# EAGLE design e407-roll-control (EAGLE 6.4)
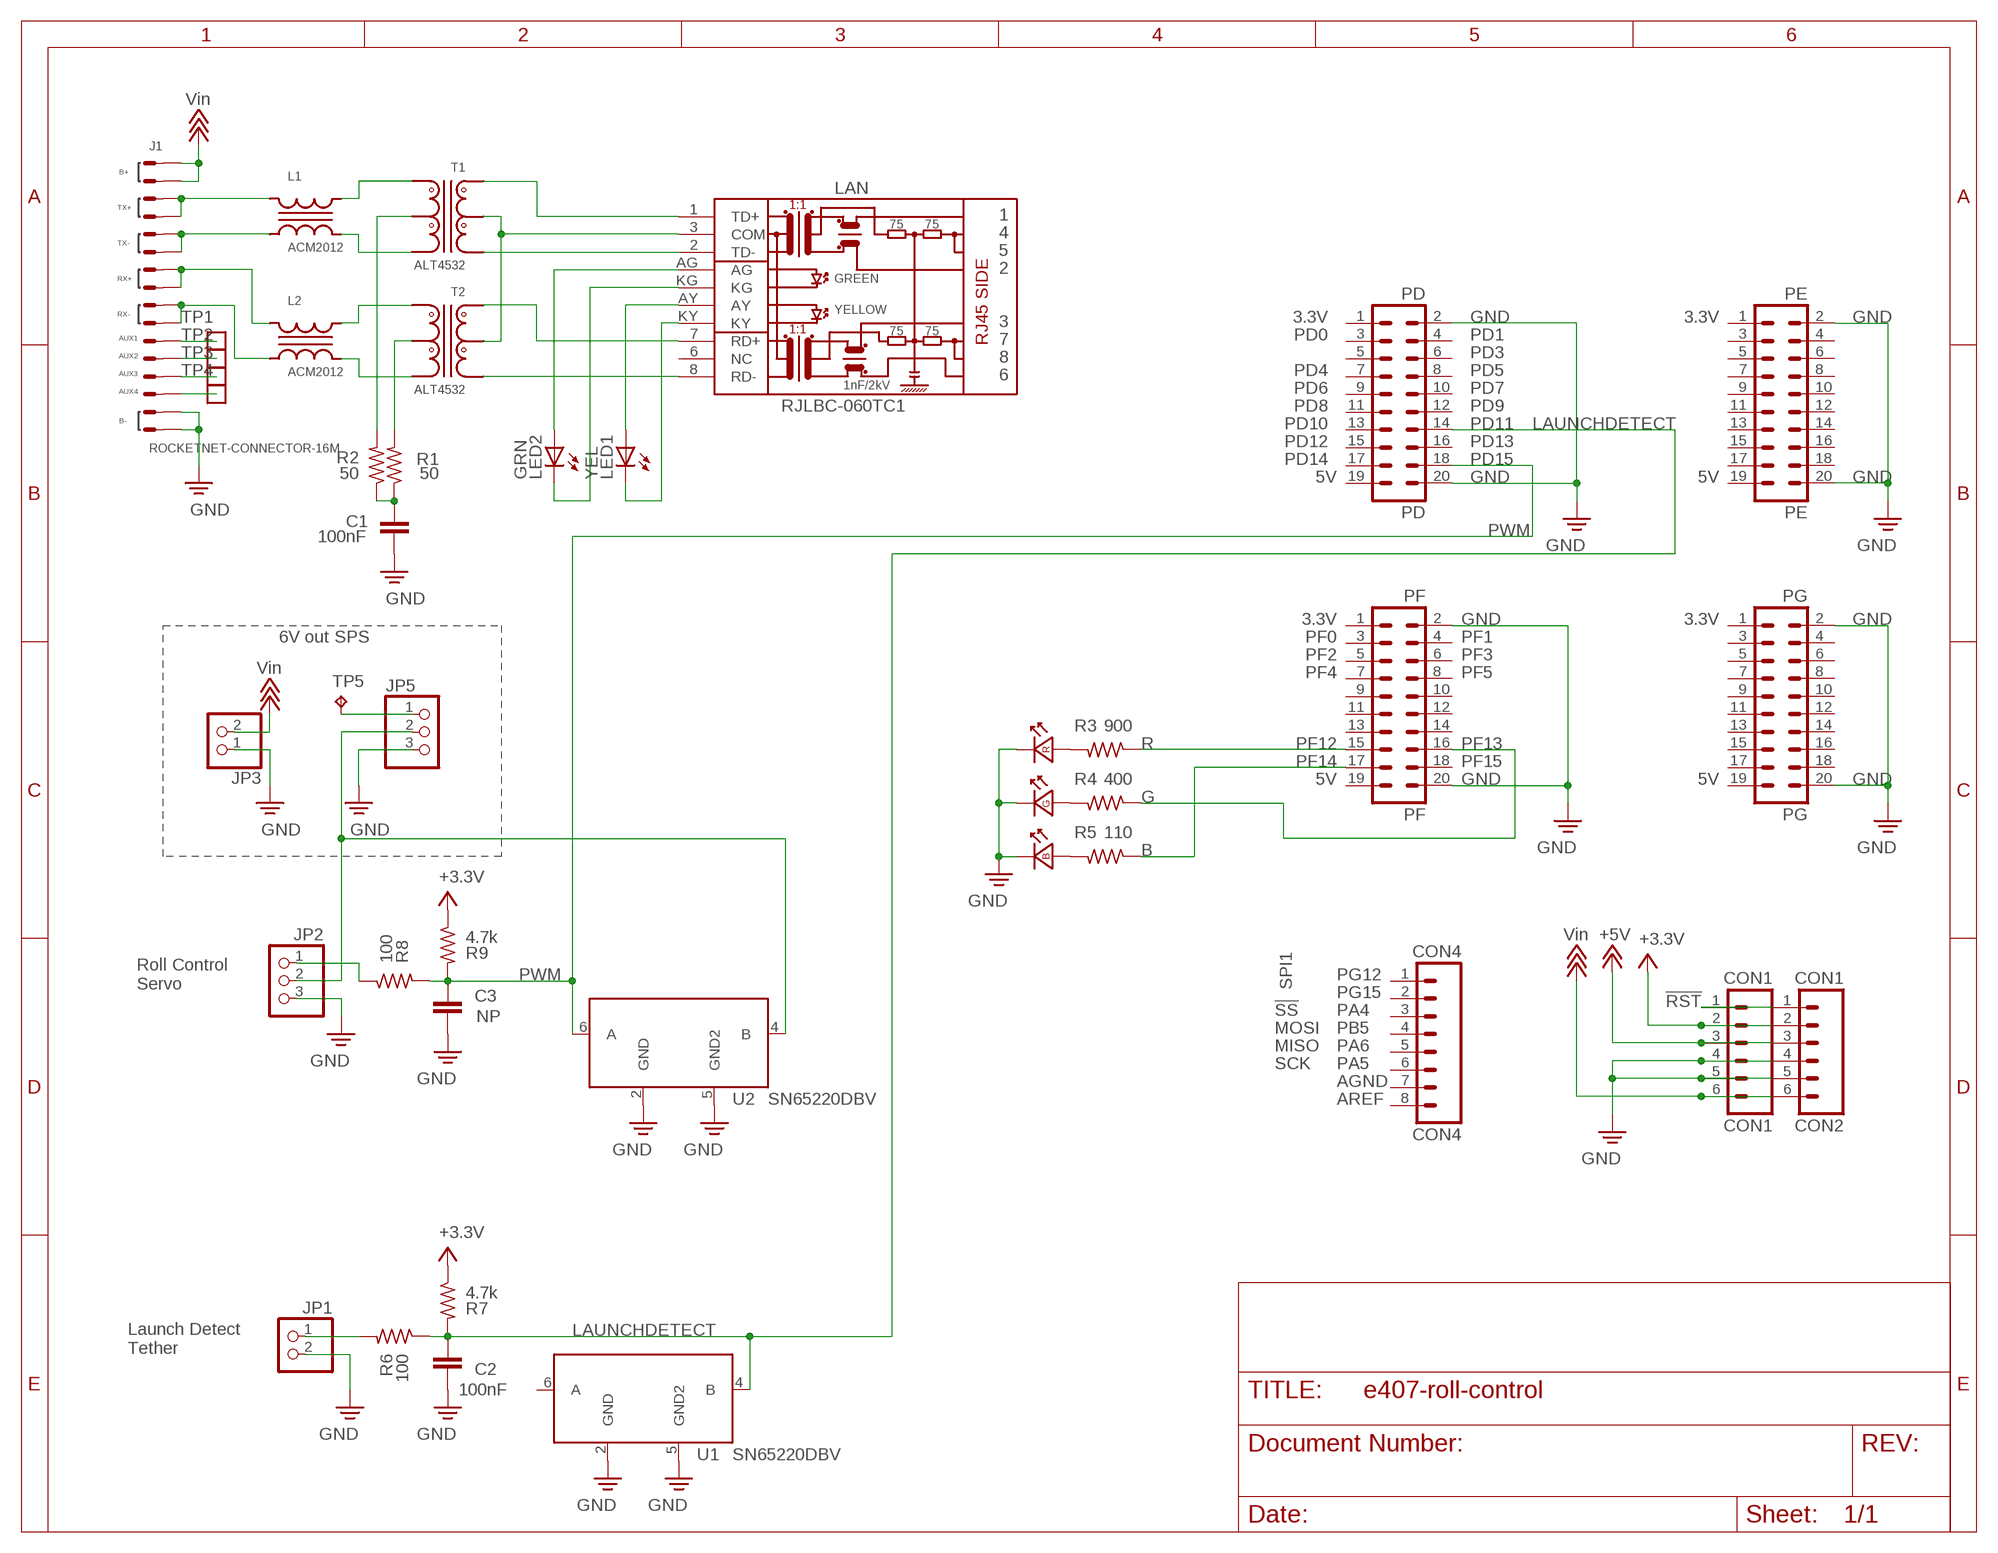
[diagram p0: schematic, sheet 1]

## Parts
C1  100nF  C-EU0603-B-NOSILK  [0603-B-NOSILK]
C2  100nF  C-EU0603-B-NOSILK  [0603-B-NOSILK]
C3  NP  C-EU0603-B-NOSILK  [0603-B-NOSILK]
CON1  CON1  M06SIP  [1X06]
CON2  CON1  M06SIP  [1X06]
CON4  CON4  M081X08  [1X08]
J1  ROCKETNET-CONNECTOR-16M  [ROCKETNET-M-16]
JP1  PINHD-1X2  [1X02]
JP2  PINHD-1X3  [1X03]
JP3  PINHD-1X2  [1X02]
JP5  PINHD-1X3  [1X03]
L1  ACM2012  [TDK-ACM2012]
L2  ACM2012  [TDK-ACM2012]
LAN  RJLBC-060TC1  [RJLBC-060TC1]
LED1  YEL  LEDCHIPLED_0603  [CHIPLED_0603]
LED2  GRN  LEDCHIPLED_0603  [CHIPLED_0603]
LED3  LED_RGB_PLCC-6  [PLCC-6]
PD  PD  ML20  [ML20]
PE  PE  ML20  [ML20]
PF  PF  ML20  [ML20]
PG  PG  ML20  [ML20]
R1  50  R-US_0603-B-NOSILK  [0603-B-NOSILK]
R2  50  R-US_0603-B-NOSILK  [0603-B-NOSILK]
R3  900  R-US_0603-B-NOSILK  [0603-B-NOSILK]
R4  400  R-US_0603-B-NOSILK  [0603-B-NOSILK]
R5  110  R-US_0603-B-NOSILK  [0603-B-NOSILK]
R6  100  R-US_0603-B-NOSILK  [0603-B-NOSILK]
R7  4.7k  R-US_0603-B-NOSILK  [0603-B-NOSILK]
R8  100  R-US_0603-B-NOSILK  [0603-B-NOSILK]
R9  4.7k  R-US_0603-B-NOSILK  [0603-B-NOSILK]
T1  ALT4532  [TDK-ALT4532]
T2  ALT4532  [TDK-ALT4532]
TP1  TEST-POINT  [2MM-TEST-POINT]
TP2  TEST-POINT  [2MM-TEST-POINT]
TP3  TEST-POINT  [2MM-TEST-POINT]
TP4  TEST-POINT  [2MM-TEST-POINT]
TP5  TPPAD1-13  [P1-13]
U1  SN65220DBV  [SOT23-6L]
U2  SN65220DBV  [SOT23-6L]

## Nets
B: PF.17 R5.1
DOUBLE_UP_ARROW: CON1.3 CON2.3 ; supply symbol labelled +5V
G: PF.16 R4.1
LAUNCHDETECT: C2.2 PD.14 R6.1 R7.2 U1.4(B)
N$3: L1.4 T1.5
N$4: CON1.1 CON2.1
N$5: L1.3 T1.4
N$6: L2.4 T2.5
N$7: L2.3 T2.4
N$8: J1.T+@13(TX+) J1.T+@14(TX+) L1.1
N$9: J1.T-@9(TX-) J1.T-@11(TX-) L1.2
N$10: J1.R+@5(RX+) J1.R+@7(RX+) L2.1
N$11: LAN.1(TD+) T1.1
N$12: LAN.2(TD-) T1.2
N$13: LAN.7(RD+) T2.1
N$14: LAN.8(RD-) T2.2
N$15: LAN.KY LED1.C
N$16: LAN.AY LED1.A
N$17: LAN.KG LED2.C
N$18: LAN.AG LED2.A
N$19: J1.R-@3(RX-) J1.R-@4(RX-) L2.2
N$20: J1.A4(AUX4) TP4.1
N$21: J1.A3(AUX3) TP3.1
N$22: J1.A2(AUX2) TP2.1
N$23: J1.A1(AUX1) TP1.1
N$24: LAN.3(COM) T1.6 T2.6
N$25: C1.1 R1.1 R2.1
N$26: R1.2 T2.3
N$27: R2.2 T1.3
N$28: LED3.1(R:A) R3.2
N$29: LED3.3(G:A) R4.2
N$30: LED3.4(B:A) R5.2
N$31: JP1.1 R6.2
N$32: JP5.1 TP5.TP
N$33: JP2.1 R8.1
N$34: JP2.2 JP5.2 U2.4(B)
PWM: C3.2 PD.18 R8.2 R9.2 U2.6(A)
R: PF.15 R3.1
TRIPLE_BAR_GND: C1.2 C2.1 C3.1 CON1.4 CON1.5 CON2.4 CON2.5 J1.B-@1(B-) J1.B-@2(B-) JP1.2 JP2.3 JP3.1 JP5.3 LED3.2(G:K) LED3.5(B:K) LED3.6(R:K) PD.2 PD.20 PE.2 PE.20 PF.2 PF.20 PG.2 PG.20 U1.2(GND) U1.5(GND2) U2.2(GND) U2.5(GND2) ; supply symbol labelled GND
TRIPLE_UP_ARROW: CON1.6 CON2.6 J1.B+@15(B+) J1.B+@16(B+) JP3.2 ; supply symbol labelled Vin
UP_ARROW: CON1.2 CON2.2 R7.1 R9.1 ; supply symbol labelled +3.3V
Unconnected: CON4.1 CON4.2 CON4.3 CON4.4 CON4.5 CON4.6 CON4.7 CON4.8 LAN.6(NC) PD.1 PD.3 PD.4 PD.5 PD.6 PD.7 PD.8 PD.9 PD.10 PD.11 PD.12 PD.13 PD.15 PD.16 PD.17 PD.19 PE.1 PE.3 PE.4 PE.5 PE.6 PE.7 PE.8 PE.9 PE.10 PE.11 PE.12 PE.13 PE.14 PE.15 PE.16 PE.17 PE.18 PE.19 PF.1 PF.3 PF.4 PF.5 PF.6 PF.7 PF.8 PF.9 PF.10 PF.11 PF.12 PF.13 PF.14 PF.18 PF.19 PG.1 PG.3 PG.4 PG.5 PG.6 PG.7 PG.8 PG.9 PG.10 PG.11 PG.12 PG.13 PG.14 PG.15 PG.16 PG.17 PG.18 PG.19 U1.6(A)

## Notes on the sheet
- 3.3V | GND | 3.3V | GND
- PD0 | PD1
- PD3
- PD4 | PD5
- PD6 | PD7
- PD8 | PD9
- PD10 | PD11
- PD12 | PD13
- PD14 | PD15
- 5V | GND | 5V | GND
- 3.3V | GND | 3.3V | GND
- 6V out SPS | PF0 | PF1
- PF2 | PF3
- PF4 | PF5
- PF12 | PF13
- PF14 | PF15
- 5V | GND | 5V | GND
- PG12
- Roll Control
  Servo
- SPI1
- PG15
- !RST
- !SS | PA4
- MOSI | PB5
- MISO | PA6
- SCK | PA5
- AGND
- AREF
- Launch Detect
  Tether

## Library data of the parts
C1-C3 = rcl_custom:C-EU: CAPACITOR, European symbol
CON1 CON2 = SparkFun-Connectors:M06: Header 6 Standard 6-pin 0.1" header. Use with straight break away headers (SKU : PRT-00116), right angle break away headers (PRT-00553), swiss pins (PRT-00743), machine pins (PRT-00117), and female headers (PRT-00115). Molex polarized connector foot print use with SKU : PRT-08094 with associated crimp pins and housings. NOTES ON THE VARIANTS LOCK and LOCK_LONGPADS... This footprint was designed to help hold the alignment of a through-hole component (i.e. 6-pin header) while soldering it into place. You may notice that each hole has been shifted either up or down by 0.005 of an inch from it's more standard position (which is a perfectly straight line). This slight alteration caused the pins (the squares in the middle) to touch the edges of the holes. Because they are alternating, it causes a "brace" to hold the component in place. 0.005 has proven to be the perfect amount of "off-center" position when using our standard breakaway headers. Although looks a little odd when you look at the bare footprint, once you have a header in there, the alteration is very hard to notice. Also, if you push a header all the way into place, it is covered up entirely on the bottom side. This idea of altering the position of holes to aid alignment will be further integrated into the Sparkfun Library for other footprints. It can help hold any component with 3 or more connection pins.
CON4 = SparkFun-Connectors:M08: Header 8 Standard 8-pin 0.1" header. Use with straight break away headers (SKU : PRT-00116), right angle break away headers (PRT-00553), swiss pins (PRT-00743), machine pins (PRT-00117), and female headers (PRT-00115).
J1 = rocketnet-connector:ROCKETNET-CONNECTOR-16
JP1 JP3 = pinhead:PINHD-1X2: PIN HEADER
JP2 JP5 = pinhead:PINHD-1X3: PIN HEADER
L1 L2 = magnetics:ACM2012
LAN = OLIMEX_CONNECTORS:RJLBC-060TC1
LED1 LED2 = led:LED: LED OSRAM: - CHIPLED LG R971, LG N971, LY N971, LG Q971, LY Q971, LO R971, LY R971 LH N974, LH R974 LS Q976, LO Q976, LY Q976 LO Q996 - Hyper CHIPLED LW Q18S LB Q993, LB Q99A, LB R99A - SideLED LS A670, LO A670, LY A670, LG A670, LP A670 LB A673, LV A673, LT A673, LW A673 LH A674 LY A675 LS A676, LA A676, LO A676, LY A676, LW A676 LS A679, LY A679, LG A679 - Hyper Micro SIDELED® LS Y876, LA Y876, LO Y876, LY Y876 LT Y87S - SmartLED LW L88C, LW L88S LB L89C, LB L89S, LG L890 LS L89K, LO L89K, LY L89K LS L896, LA L896, LO L896, LY L896 - TOPLED LS T670, LO T670, LY T670, LG T670, LP T670 LSG T670, LSP T670, LSY T670, LOP T670, LYG T670 LG T671, LOG T671, LSG T671 LB T673, LV T673, LT T673, LW T673 LH T674 LS T676, LA T676, LO T676, LY T676, LB T676, LH T676, LSB T676, LW T676 LB T67C, LV T67C, LT T67C, LS T67K, LO T67K, LY T67K, LW E67C LS E67B, LA E67B, LO E67B, LY E67B, LB E67C, LV E67C, LT E67C LW T67C LS T679, LY T679, LG T679 LS T770, LO T770, LY T770, LG T770, LP T770 LB T773, LV T773, LT T773, LW T773 LH T774 LS E675, LA E675, LY E675, LS T675 LS T776, LA T776, LO T776, LY T776, LB T776 LHGB T686 LT T68C, LB T68C - Hyper Mini TOPLED® LB M676 - Mini TOPLED Santana® LG M470 LS M47K, LO M47K, LY M47K Source: http://www.osram.convergy.de LUXEON: - LUMILED® LXK2-PW12-R00, LXK2-PW12-S00, LXK2-PW14-U00, LXK2-PW14-V00 LXK2-PM12-R00, LXK2-PM12-S00, LXK2-PM14-U00 LXK2-PE12-Q00, LXK2-PE12-R00, LXK2-PE12-S00, LXK2-PE14-T00, LXK2-PE14-U00 LXK2-PB12-K00, LXK2-PB12-L00, LXK2-PB12-M00, LXK2-PB14-N00, LXK2-PB14-P00, LXK2-PB14-Q00 LXK2-PR12-L00, LXK2-PR12-M00, LXK2-PR14-Q00, LXK2-PR14-R00 LXK2-PD12-Q00, LXK2-PD12-R00, LXK2-PD12-S00 LXK2-PH12-R00, LXK2-PH12-S00 LXK2-PL12-P00, LXK2-PL12-Q00, LXK2-PL12-R00 Source: www.luxeon.com KINGBRIGHT: KA-3528ASYC Source: www.kingbright.com
LED3 = Tova:LED_RGB_*: RGB LED with separate contacts for all 3 chips
PD PE PF PG = con-harting-ml:ML20: HARTING; OC_FARNELL: unknown; OC_NEWARK: unknown
R1-R9 = rcl_custom:R-US_: RESISTOR, American symbol
T1 T2 = magnetics:ALT4532
TP1-TP4 = apdm:TEST-POINT
TP5 = testpad:TP: Test pad
U1 U2 = sn65220:SN65220

## Net classes
1 PWR: width 0.203 mm, drill 0.4 mm, clearance 0.076 mm

## Board
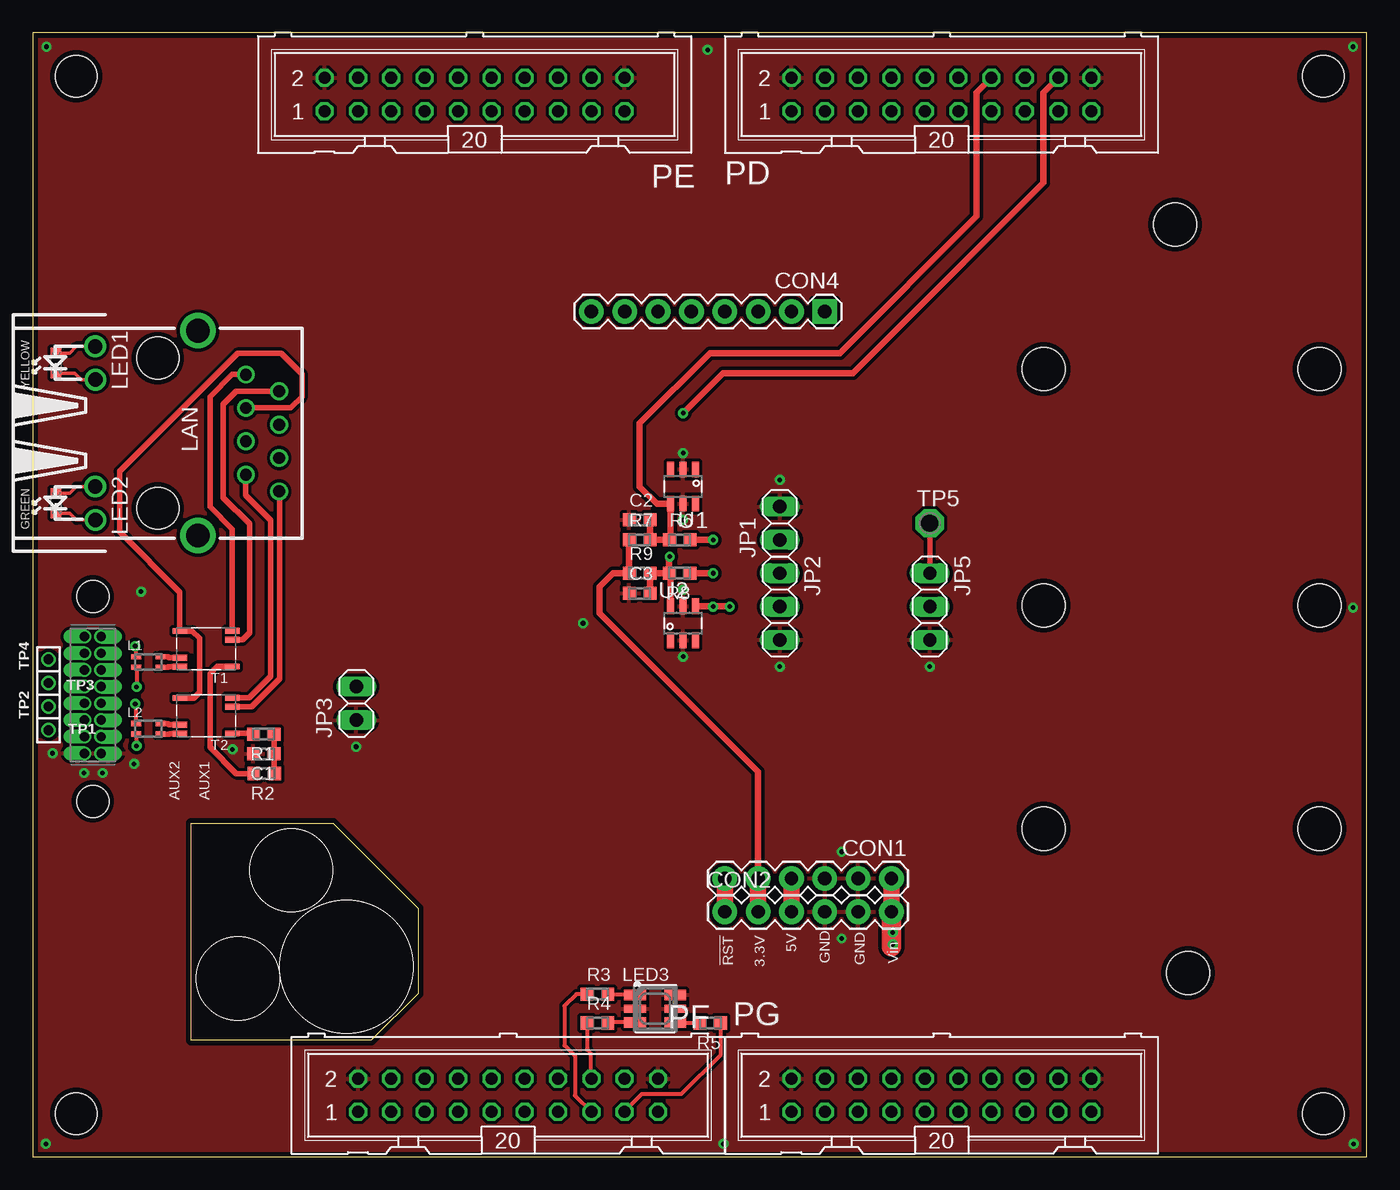
[diagram p1: board, top side]
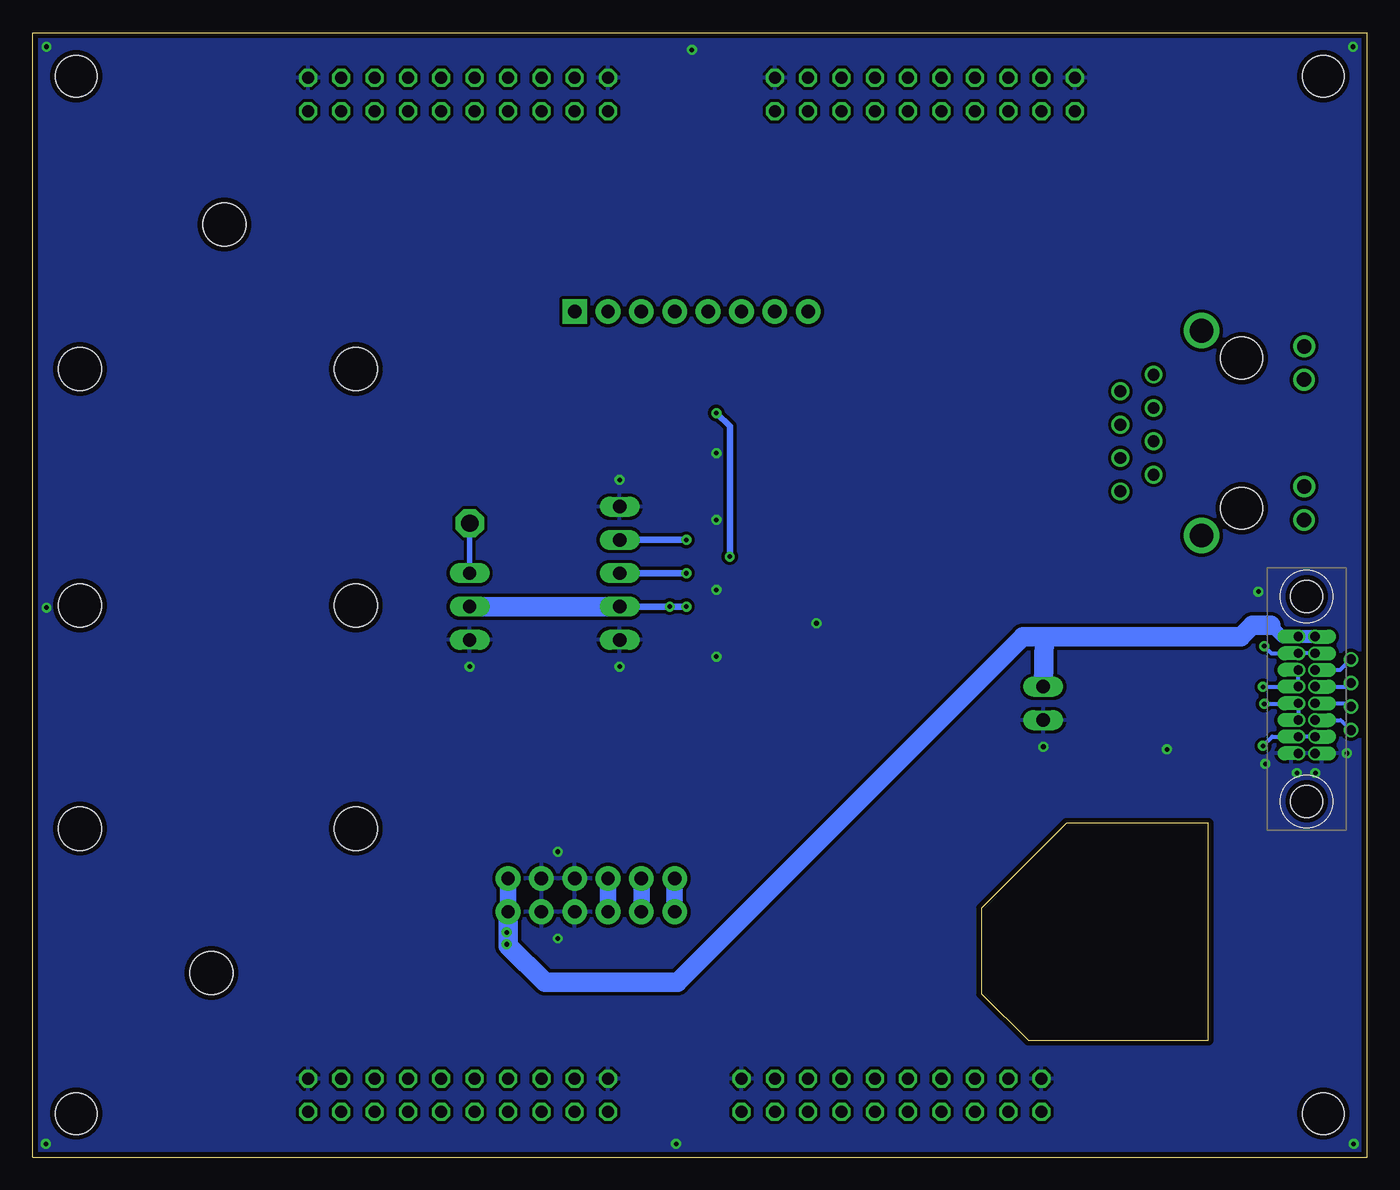
[diagram p2: board, bottom side, seen from below]

Size 101.6 x 85.6 mm. Coordinates in mm from the lower left corner, seen from the top.
Outline: 101.6,0 0,0 0,85.6 101.6,85.6 101.6,0
Outline: 25.78,8.89 12.06,8.89 12.06,25.4 22.86,25.4 29.34,18.92 29.34,12.45 25.78,8.89
Copper layers (1*16): Top 0.0178mm / dielectric 59mil / Bottom 0.0178mm
Design rules "epl-lpkf *": minimum track width 8mil, minimum drill 0.35mm, track to track 8mil, track to pad 8mil, pad to pad 8mil, via to via 8mil, smd to smd 8mil, copper to edge 15mil, drill to drill 15mil, minimum pad ring 0mil, minimum via ring 8mil, stop-mask expansion 1mil, vias tented up to drill 0mil, thermal gap 10mil
Holes 3.17 mm at 98.3,3.3 98.3,82.3 3.3,82.3 3.3,3.3
Holes 3.3 mm at 98,60 77,60 77,25 98,25 98,42 77,42 88,14 87,71

### Footprints (pad centres in the part's own frame; a part is rotated, then mirrored left to right if it is on the bottom)
0603-B-NOSILK = smd 0.95 x 1: 1 -0.8,0; 2 0.8,0
1X06 = drill 1.016 pad 1.88: 1 0,0; 2 2.54,0; 3 5.08,0; 4 7.62,0; 5 10.16,0; 6 12.7,0
1X08 = drill 1.016 pad 1.88 square: 1 0,0 | drill 1.016 pad 1.88: 2 2.54,0; 3 5.08,0; 4 7.62,0; 5 10.16,0; 6 12.7,0; 7 15.24,0; 8 17.78,0
ROCKETNET-M-16 = drill 0.71 pad 0.95 offset: A1 -1.905,0.635; A2 -0.635,0.635; A3 0.635,0.635; A4 1.905,0.635; B+@15 4.445,-0.635; B+@16 4.445,0.635; B-@1 -4.445,-0.635; B-@2 -4.445,0.635; R+@5 -1.905,-0.635; R+@7 -0.635,-0.635; R-@3 -3.175,-0.635; R-@4 -3.175,0.635; T+@13 3.175,-0.635; T+@14 3.175,0.635; T-@9 0.635,-0.635; T-@11 1.905,-0.635 | hole 2.438: 7.5,0; -8.1,0
1X02 = drill 1.016 long: 1 -1.27,0; 2 1.27,0
1X03 = drill 1.016 long: 1 -2.54,0; 2 0,0; 3 2.54,0
TDK-ACM2012 = smd 0.75 x 0.4: 1 -0.925,0.4; 2 -0.925,-0.4; 3 0.925,-0.4; 4 0.925,0.4
RJLBC-060TC1 = drill 0.9: 1 -4.455,6.7; 2 -3.185,9.24; 3 -1.915,6.7; 4 -0.645,9.24; 5 0.625,6.7; 6 1.895,9.24; 7 3.165,6.7; 8 4.435,9.24 | drill 1.1: AG 4.07,-4.773; AY -6.61,-4.773; KG 6.61,-4.748; KY -4.07,-4.748 | drill 1.8: GND1 -7.8,3.05; GND2 7.8,3.05 | hole 3.2: -5.715,0; 5.715,0
CHIPLED_0603 = smd 0.8 x 0.8: A 0,-0.75; C 0,0.75
PLCC-6 = smd 1.65 x 0.8: 1 -1.525,1.05; 3 -1.525,-1.05; 4 1.525,-1.05; 6 1.525,1.05 | smd 1.65 x 0.6: 2 -1.525,0; 5 1.525,0
ML20 = drill 0.914 octagon: 1 -11.43,-1.27; 2 -11.43,1.27; 3 -8.89,-1.27; 4 -8.89,1.27; 5 -6.35,-1.27; 6 -6.35,1.27; 7 -3.81,-1.27; 8 -3.81,1.27; 9 -1.27,-1.27; 10 -1.27,1.27; 11 1.27,-1.27; 12 1.27,1.27; 13 3.81,-1.27; 14 3.81,1.27; 15 6.35,-1.27; 16 6.35,1.27; 17 8.89,-1.27; 18 8.89,1.27; 19 11.43,-1.27; 20 11.43,1.27
TDK-ALT4532 = smd 1.1 x 0.45: 1 -2,-1.375; 2 -2,-0.675; 3 -2,1.35; 4 2,1.375; 5 2,0.675; 6 2,-1.35
2MM-TEST-POINT = drill 0.737: 1 0,0
P1-13 = drill 1.321 pad 2.159 octagon: TP 0,0
SOT23-6L = smd 0.55 x 1.2: 1 -0.95,-1.3; 2 0,-1.3; 3 0.95,-1.3; 4 0.95,1.3; 5 0,1.3; 6 -0.95,1.3

### Placement (x,y rotation side)
C1  17.6,30.7 180 top
C2  46.23,48.51 0 top
C3  46.23,42.93 0 top
CON1  52.7,21.21 0 top
CON2  52.7,18.67 0 top
CON4  60.33,64.39 180 top
J1  4.57,35.18 90 top
JP1  56.9,48.26 90 top
JP2  56.9,41.91 270 top
JP3  24.64,34.54 90 top
JP5  68.33,41.91 270 top
L1  8.8,37.7 0 top
L2  8.8,32.6 0 top
LAN  9.53,55.12 270 top
LED1  1.78,60.45 180 top
LED2  1.78,49.78 180 top
LED3  47.4,11.3 0 top
PD  69.22,80.9 0 top
PE  33.66,80.9 0 top
PF  36.2,4.7 0 top
PG  69.22,4.7 0 top
R1  17.6,32.2 180 top
R2  17.63,29.2 180 top
R3  43,12.4 0 top
R4  43,10.2 0 top
R5  51.6,10.2 180 top
R6  49.28,46.99 0 top
R7  46.23,46.99 0 top
R8  49.28,44.45 180 top
R9  46.23,44.45 0 top
T1  13.2,38.7 180 top
T2  13.2,33.6 180 top
TP1  1.2,32.5 0 top
TP2  1.2,34.3 0 top
TP3  1.2,36.1 0 top
TP4  1.2,37.9 0 top
TP5  68.33,48.26 0 top
U1  49.53,51.05 180 top
U2  49.53,40.64 0 top

### Tracks (layer width: path | path; a pad name or v marks a point on that pad's centre or on a via)
B
  Top 0.3: PF.17 45.09,3.48 46.4,4.8 49.4,4.8 52.4,7.8 R5.1
DOUBLE_UP_ARROW
  Top 1.27: CON1.3 CON2.3
  Bottom 1.27: CON1.3 CON2.3
G
  Top 0.3: R4.1 42.2,8.2 42.5,7.9 42.5,6.01 PF.16
LAUNCHDETECT
  Top 0.508: C2.2 R7.2 R6.1 48.58,47.09 U1.4 47.53,49.75 46.23,51.05 46.23,55.88 51.56,61.21 61.47,61.21 71.88,71.63 71.88,81.03 PD.14
N$3
  Top 0.406: T1.5 10.38,38.02 10.3,38.1 L1.4
N$4
  Top 1.27: CON1.1 CON2.1
  Bottom 1.27: CON1.1 CON2.1
N$5
  Top 0.406: T1.4 10.32,37.33 10.3,37.3 L1.3
N$6
  Top 0.406: T2.5 10.38,32.92 10.3,33 L2.4
N$7
  Top 0.406: T2.4 10.43,32.23 10.4,32.2 L2.3
N$8  (via drill 0.35)
  Top 0.3: L1.1 7.88,38.9 v7.8,38.9
  Bottom 0.3: J1.T+@14 J1.T+@13 7.25,38.35 v7.8,38.9
N$9  (via drill 0.35)
  Top 0.3: L1.2 7.9,37.27 v7.9,35.8
  Bottom 0.3: J1.T-@11 J1.T-@9 7.89,35.81 v7.9,35.8
N$10  (via drill 0.35)
  Top 0.3: L2.1 7.88,34.42 v7.8,34.5
  Bottom 0.3: J1.R+@5 J1.R+@7 5.25,34.5 v7.8,34.5
N$11
  Top 0.406: T1.1 15.2,47.8 13.5,49.5 13.5,57.9 15.2,59.6 16.2,59.6 LAN.1
N$12
  Top 0.406: T1.2 15.97,39.38 16.5,39.9 16.5,48.2 14.5,50.2 14.5,57.3 15.5,58.3 LAN.2
N$13
  Top 0.406: T2.1 16.48,34.98 18.1,36.6 18.1,48.5 16.2,50.4 16.2,51.93 LAN.7
N$14
  Top 0.406: T2.2 16.68,34.27 18.8,36.4 18.8,50.65 LAN.8
N$15
  Top 0.254: LAN.KY 3.68,59.19 3.17,59.69 LED1.C
N$16
  Top 0.254: LAN.AY 3.31,61.73 2.79,61.21 1.79,61.21 LED1.A
N$17
  Top 0.254: LAN.KG 3.31,48.51 2.79,49.02 LED2.C
N$18
  Top 0.254: LAN.AG 3.3,51.05 2.79,50.55 1.79,50.55 LED2.A
N$19  (via drill 0.35)
  Top 0.3: L2.2 7.88,31.32 v7.9,31.3
  Bottom 0.3: J1.R-@4 J1.R-@3 7.2,32 v7.9,31.3
N$20
  Bottom 0.3: J1.A4 2.02,37.08 TP4.1
N$21
  Bottom 0.3: J1.A3 1.49,35.81 TP3.1
N$22
  Bottom 0.3: J1.A2 1.44,34.54 TP2.1
N$23
  Bottom 0.3: J1.A1 1.97,33.27 TP1.1
N$24
  Top 0.406: T2.6 12.25,34.95 12.7,35.4 12.7,39.5 12.15,40.05 T1.6 11.2,43 6.6,47.6 6.6,52.2 15.6,61.2 18.9,61.2 20.5,59.6 20.5,57.9 19.63,57.03 LAN.3
N$25
  Top 0.406: R1.1 C1.1 18.4,29.23 R2.1
N$26
  Top 0.406: T2.3 16.78,32.25 R1.2
N$27
  Top 0.406: T1.3 14.05,37.35 13.5,36.8 13.5,31.2 15.5,29.2 R2.2
N$28
  Top 0.3: LED3.1 43.85,12.35 R3.2
N$29
  Top 0.3: LED3.3 43.85,10.25 R4.2
N$30
  Top 0.3: R5.2 48.98,10.2 LED3.4
N$31  (via drill 0.35)
  Top 0.508: v51.82,46.99 R6.2
  Bottom 0.508: JP1.1 v51.82,46.99
N$32
  Top 0.4: JP5.1 TP5.TP 68.37,48.3
  Bottom 0.4: TP5.TP JP5.1
N$33  (via drill 0.35)
  Top 0.508: v51.82,44.45 R8.1
  Bottom 0.508: JP2.1 v51.82,44.45
N$34  (via drill 0.35)
  Top 0.508: 56.87,41.94 JP2.2 | U2.4 51.79,41.94 | 51.79,41.94 v51.82,41.91 | 51.79,41.94 53.06,41.94 v53.09,41.91
  Bottom 0.508: v51.82,41.91 57.4,41.91
  Bottom 1.5: JP5.2 57.4,41.91 JP2.2
PWM  (via drill 0.35)
  Top 0.508: U2.6 48.58,44.3 R8.2 | C3.2 R9.2 R8.2 | R8.2 48.48,45.68 v48.51,45.72 | v49.53,56.64 52.58,59.69 62.48,59.69 76.96,74.17 76.96,81.03 PD.18
  Bottom 0.508: v48.51,45.72 48.51,55.63 v49.53,56.64
R
  Top 0.3: R3.1 41.4,12.4 40.5,11.5 40.5,8.5 41.3,7.7 41.3,4.67 PF.15
TRIPLE_BAR_GND  (via drill 0.35 pad 0.58)
  other vias: 1.04,84.54 100.56,84.54 100.6,1 1,1 41.91,40.64 100.56,41.83 24.62,31.24 8.24,43.05 15.21,31.04 61.61,23.24 61.61,16.64 1.51,30.74 7.71,29.94 3.91,29.24 5.31,29.24 49.53,38.1 49.53,43.18 52.6,1 51.4,84.3 49.53,48.51 49.53,53.59 56.9,37.34 68.33,37.34 56.9,51.56
  pour Bottom (isolate 0.254): 0,0 101.6,0 101.6,85.6 0,85.6
  pour Top (isolate 0.254): 0,0 0,85.6 101.6,85.6 101.6,0
TRIPLE_UP_ARROW  (via drill 0.35)
  Top 0.254: v65.5,17.1 65.5,16.9 65.4,16.9 | v65.5,16.2 65.5,16.3 65.4,16.3
  Top 1.27: CON1.6 65.41,18.85 | 65.41,18.85 CON2.6 | 65.41,18.85 65.4,18.84
  Top 1.5: 65.4,18.84 65.4,16.9 65.4,16.3 65.4,16
  Bottom 1: J1.B+@16 J1.B+@15 6.42,39.62 7.3,40.5 | CON2.6
  Bottom 1.27: CON1.6 CON2.6
  Bottom 1.5: 24.55,39.6 9.6,39.6 8.7,40.5 7.3,40.5 | CON2.6 65.4,16.1 62.6,13.3 52.5,13.3 26.18,39.6 24.55,39.6 | 24.55,39.6 JP3.2
UP_ARROW
  Top 0.508: CON1.2 55.24,29.34 43.18,41.4 43.18,43.43 44.2,44.45 R9.1 R7.1
  Top 1.27: CON1.2 CON2.2
  Bottom 1.27: CON1.2 CON2.2

### Text on the board
tPlace: AUX2 | AUX1 | 5V | !RST | GND | GND | Vin | 3.3V
tDocu: TOP | TOP | TOP | TOP | TOP | TOP | TOP